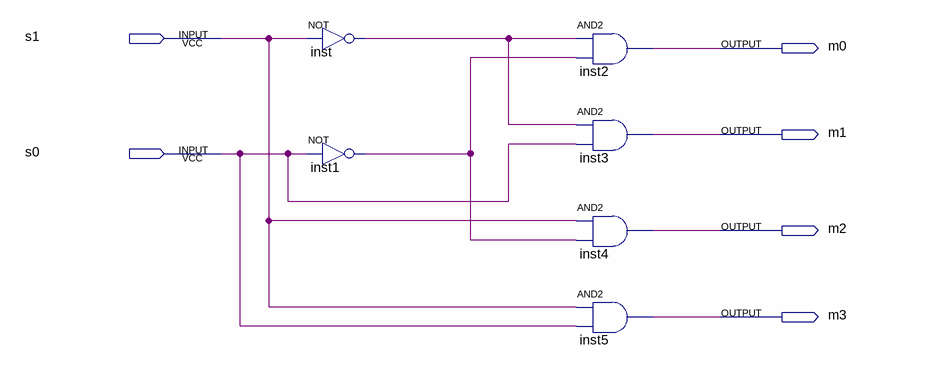
[diagram p0: schematic sheet]
// Quartus schematic decoder2-4.bdf as structural Verilog: 6 symbols, 6 pins
module \decoder2-4  (
  input  s1,
  input  s0,
  output m0,
  output m1,
  output m2,
  output m3
);

  wire inst1_out, inst_out;

  not inst (inst_out, s1);
  not inst1 (inst1_out, s0);
  and inst2 (m0, inst_out, inst1_out);
  and inst3 (m1, inst_out, s0);
  and inst4 (m2, s1, inst1_out);
  and inst5 (m3, s1, s0);
endmodule
